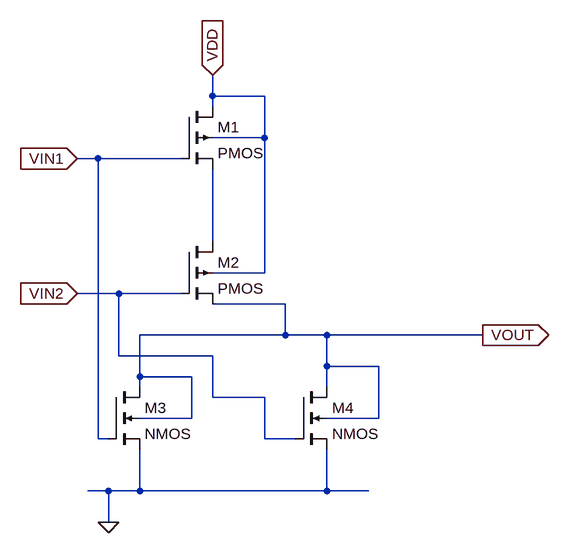
[diagram p0: schematic nor.asc]
nor.asc, the LTspice schematic file:
Version 4
SHEET 1 880 680
WIRE -32 -48 -32 -80
WIRE 48 -48 -32 -48
WIRE -32 -32 -32 -48
WIRE 48 16 48 -48
WIRE 48 16 -32 16
WIRE -208 48 -240 48
WIRE -80 48 -208 48
WIRE -32 176 -32 64
WIRE 48 224 48 16
WIRE 48 224 -32 224
WIRE -176 256 -240 256
WIRE -80 256 -176 256
WIRE 80 272 -32 272
WIRE 80 320 80 272
WIRE 80 320 -144 320
WIRE 144 320 80 320
WIRE 384 320 144 320
WIRE -176 352 -176 256
WIRE -32 352 -176 352
WIRE 144 368 144 320
WIRE 224 368 144 368
WIRE -144 384 -144 320
WIRE -64 384 -144 384
WIRE -144 400 -144 384
WIRE 144 400 144 368
WIRE -32 416 -32 352
WIRE 48 416 -32 416
WIRE -64 448 -64 384
WIRE -64 448 -144 448
WIRE 224 448 224 368
WIRE 224 448 144 448
WIRE -208 480 -208 48
WIRE -192 480 -208 480
WIRE 48 480 48 416
WIRE 96 480 48 480
WIRE -192 560 -224 560
WIRE -144 560 -144 496
WIRE -144 560 -192 560
WIRE 144 560 144 496
WIRE 144 560 -144 560
WIRE 208 560 144 560
WIRE -192 608 -192 560
FLAG -32 -80 VDD
IOPIN -32 -80 In
FLAG -240 48 VIN1
IOPIN -240 48 In
FLAG -240 256 VIN2
IOPIN -240 256 In
FLAG 384 320 VOUT
IOPIN 384 320 Out
FLAG -192 608 0
SYMBOL pmos4 -80 -32 R0
SYMATTR InstName M1
SYMBOL pmos4 -80 176 R0
SYMATTR InstName M2
SYMBOL nmos4 -192 400 R0
SYMATTR InstName M3
SYMBOL nmos4 96 400 R0
SYMATTR InstName M4

The netlist it stands for:
* nor.asc
M1 VDD VIN1 N001 VDD PMOS
M2 N001 VIN2 VOUT VDD PMOS
M3 VOUT VIN1 0 VOUT NMOS
M4 VOUT VIN2 0 VOUT NMOS
.model NMOS NMOS
.model PMOS PMOS
.lib standard.mos
.backanno
.end